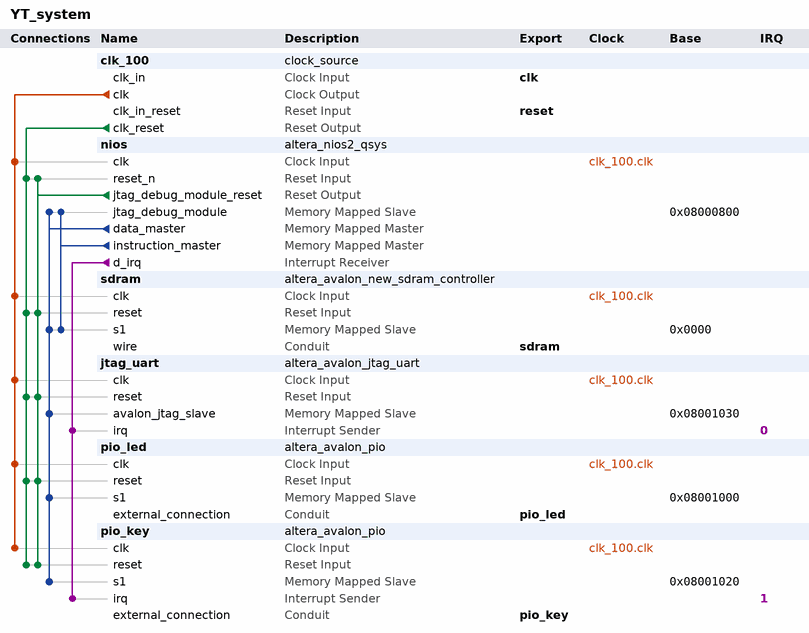
[diagram p0: system contents]
# Platform Designer (Qsys) system YT_system, Cyclone IV E EP4CE115F29C7
# Parameters at their usual value, and those the tool derives, are not listed.
package require -exact qsys 13.0.1
create_system YT_system
set_project_property DEVICE_FAMILY {Cyclone IV E}
set_project_property DEVICE EP4CE115F29C7

add_instance clk_100 clock_source 13.0
set_instance_parameter_value clk_100 clockFrequency 50000000

add_instance nios altera_nios2_qsys 13.0
set_instance_parameter_value nios resetSlave sdram.s1
set_instance_parameter_value nios mmu_TLBMissExcSlave None
set_instance_parameter_value nios exceptionSlave sdram.s1
set_instance_parameter_value nios breakSlave nios.jtag_debug_module
set_instance_parameter_value nios impl Fast
set_instance_parameter_value nios icache_size 4096

add_instance sdram altera_avalon_new_sdram_controller 13.0.1
set_instance_parameter_value sdram TAC 5.5
set_instance_parameter_value sdram TRCD 20.0
set_instance_parameter_value sdram TRP 20.0
set_instance_parameter_value sdram casLatency 3
set_instance_parameter_value sdram columnWidth 10
set_instance_parameter_value sdram dataWidth 32
set_instance_parameter_value sdram generateSimulationModel true
set_instance_parameter_value sdram model single_Micron_MT48LC4M32B2_7_chip
set_instance_parameter_value sdram numberOfBanks 4
set_instance_parameter_value sdram numberOfChipSelects 1
set_instance_parameter_value sdram powerUpDelay 100.0
set_instance_parameter_value sdram refreshPeriod 15.625
set_instance_parameter_value sdram rowWidth 13

add_instance jtag_uart altera_avalon_jtag_uart 13.0.1
set_instance_parameter_value jtag_uart simInteractiveOptions NO_INTERACTIVE_WINDOWS

add_instance pio_led altera_avalon_pio 13.0.1
set_instance_parameter_value pio_led bitModifyingOutReg true
set_instance_parameter_value pio_led direction Output
set_instance_parameter_value pio_led resetValue 15
set_instance_parameter_value pio_led width 4

add_instance pio_key altera_avalon_pio 13.0.1
set_instance_parameter_value pio_key captureEdge true
set_instance_parameter_value pio_key direction Input
set_instance_parameter_value pio_key edgeType FALLING
set_instance_parameter_value pio_key generateIRQ true
set_instance_parameter_value pio_key width 2

# connections
add_connection clk_100.clk jtag_uart.clk clock
add_connection clk_100.clk nios.clk clock
add_connection clk_100.clk pio_key.clk clock
add_connection clk_100.clk pio_led.clk clock
add_connection clk_100.clk sdram.clk clock
add_connection clk_100.clk_reset jtag_uart.reset reset
add_connection clk_100.clk_reset nios.reset_n reset
add_connection clk_100.clk_reset pio_key.reset reset
add_connection clk_100.clk_reset pio_led.reset reset
add_connection clk_100.clk_reset sdram.reset reset
add_connection nios.jtag_debug_module_reset jtag_uart.reset reset
add_connection nios.jtag_debug_module_reset nios.reset_n reset
add_connection nios.jtag_debug_module_reset pio_key.reset reset
add_connection nios.jtag_debug_module_reset pio_led.reset reset
add_connection nios.jtag_debug_module_reset sdram.reset reset
add_connection nios.data_master jtag_uart.avalon_jtag_slave avalon
set_connection_parameter_value nios.data_master/jtag_uart.avalon_jtag_slave baseAddress 0x08001030
add_connection nios.data_master nios.jtag_debug_module avalon
set_connection_parameter_value nios.data_master/nios.jtag_debug_module baseAddress 0x08000800
add_connection nios.data_master pio_key.s1 avalon
set_connection_parameter_value nios.data_master/pio_key.s1 baseAddress 0x08001020
add_connection nios.data_master pio_led.s1 avalon
set_connection_parameter_value nios.data_master/pio_led.s1 baseAddress 0x08001000
add_connection nios.data_master sdram.s1 avalon
set_connection_parameter_value nios.data_master/sdram.s1 baseAddress 0x0000
add_connection nios.instruction_master nios.jtag_debug_module avalon
set_connection_parameter_value nios.instruction_master/nios.jtag_debug_module baseAddress 0x08000800
add_connection nios.instruction_master sdram.s1 avalon
set_connection_parameter_value nios.instruction_master/sdram.s1 baseAddress 0x0000
add_connection nios.d_irq jtag_uart.irq interrupt
set_connection_parameter_value nios.d_irq/jtag_uart.irq irqNumber 0
add_connection nios.d_irq pio_key.irq interrupt
set_connection_parameter_value nios.d_irq/pio_key.irq irqNumber 1

# exported interfaces
add_interface clk clock sink
set_interface_property clk EXPORT_OF clk_100.clk_in
add_interface reset reset sink
set_interface_property reset EXPORT_OF clk_100.clk_in_reset
add_interface sdram conduit end
set_interface_property sdram EXPORT_OF sdram.wire
add_interface pio_led conduit end
set_interface_property pio_led EXPORT_OF pio_led.external_connection
add_interface pio_key conduit end
set_interface_property pio_key EXPORT_OF pio_key.external_connection

set_interconnect_requirement {$system} qsys_mm.clockCrossingAdapter HANDSHAKE
set_interconnect_requirement {$system} qsys_mm.maxAdditionalLatency 1

save_system YT_system.qsys
